# Altium project STM32-PCB.PrjPcb
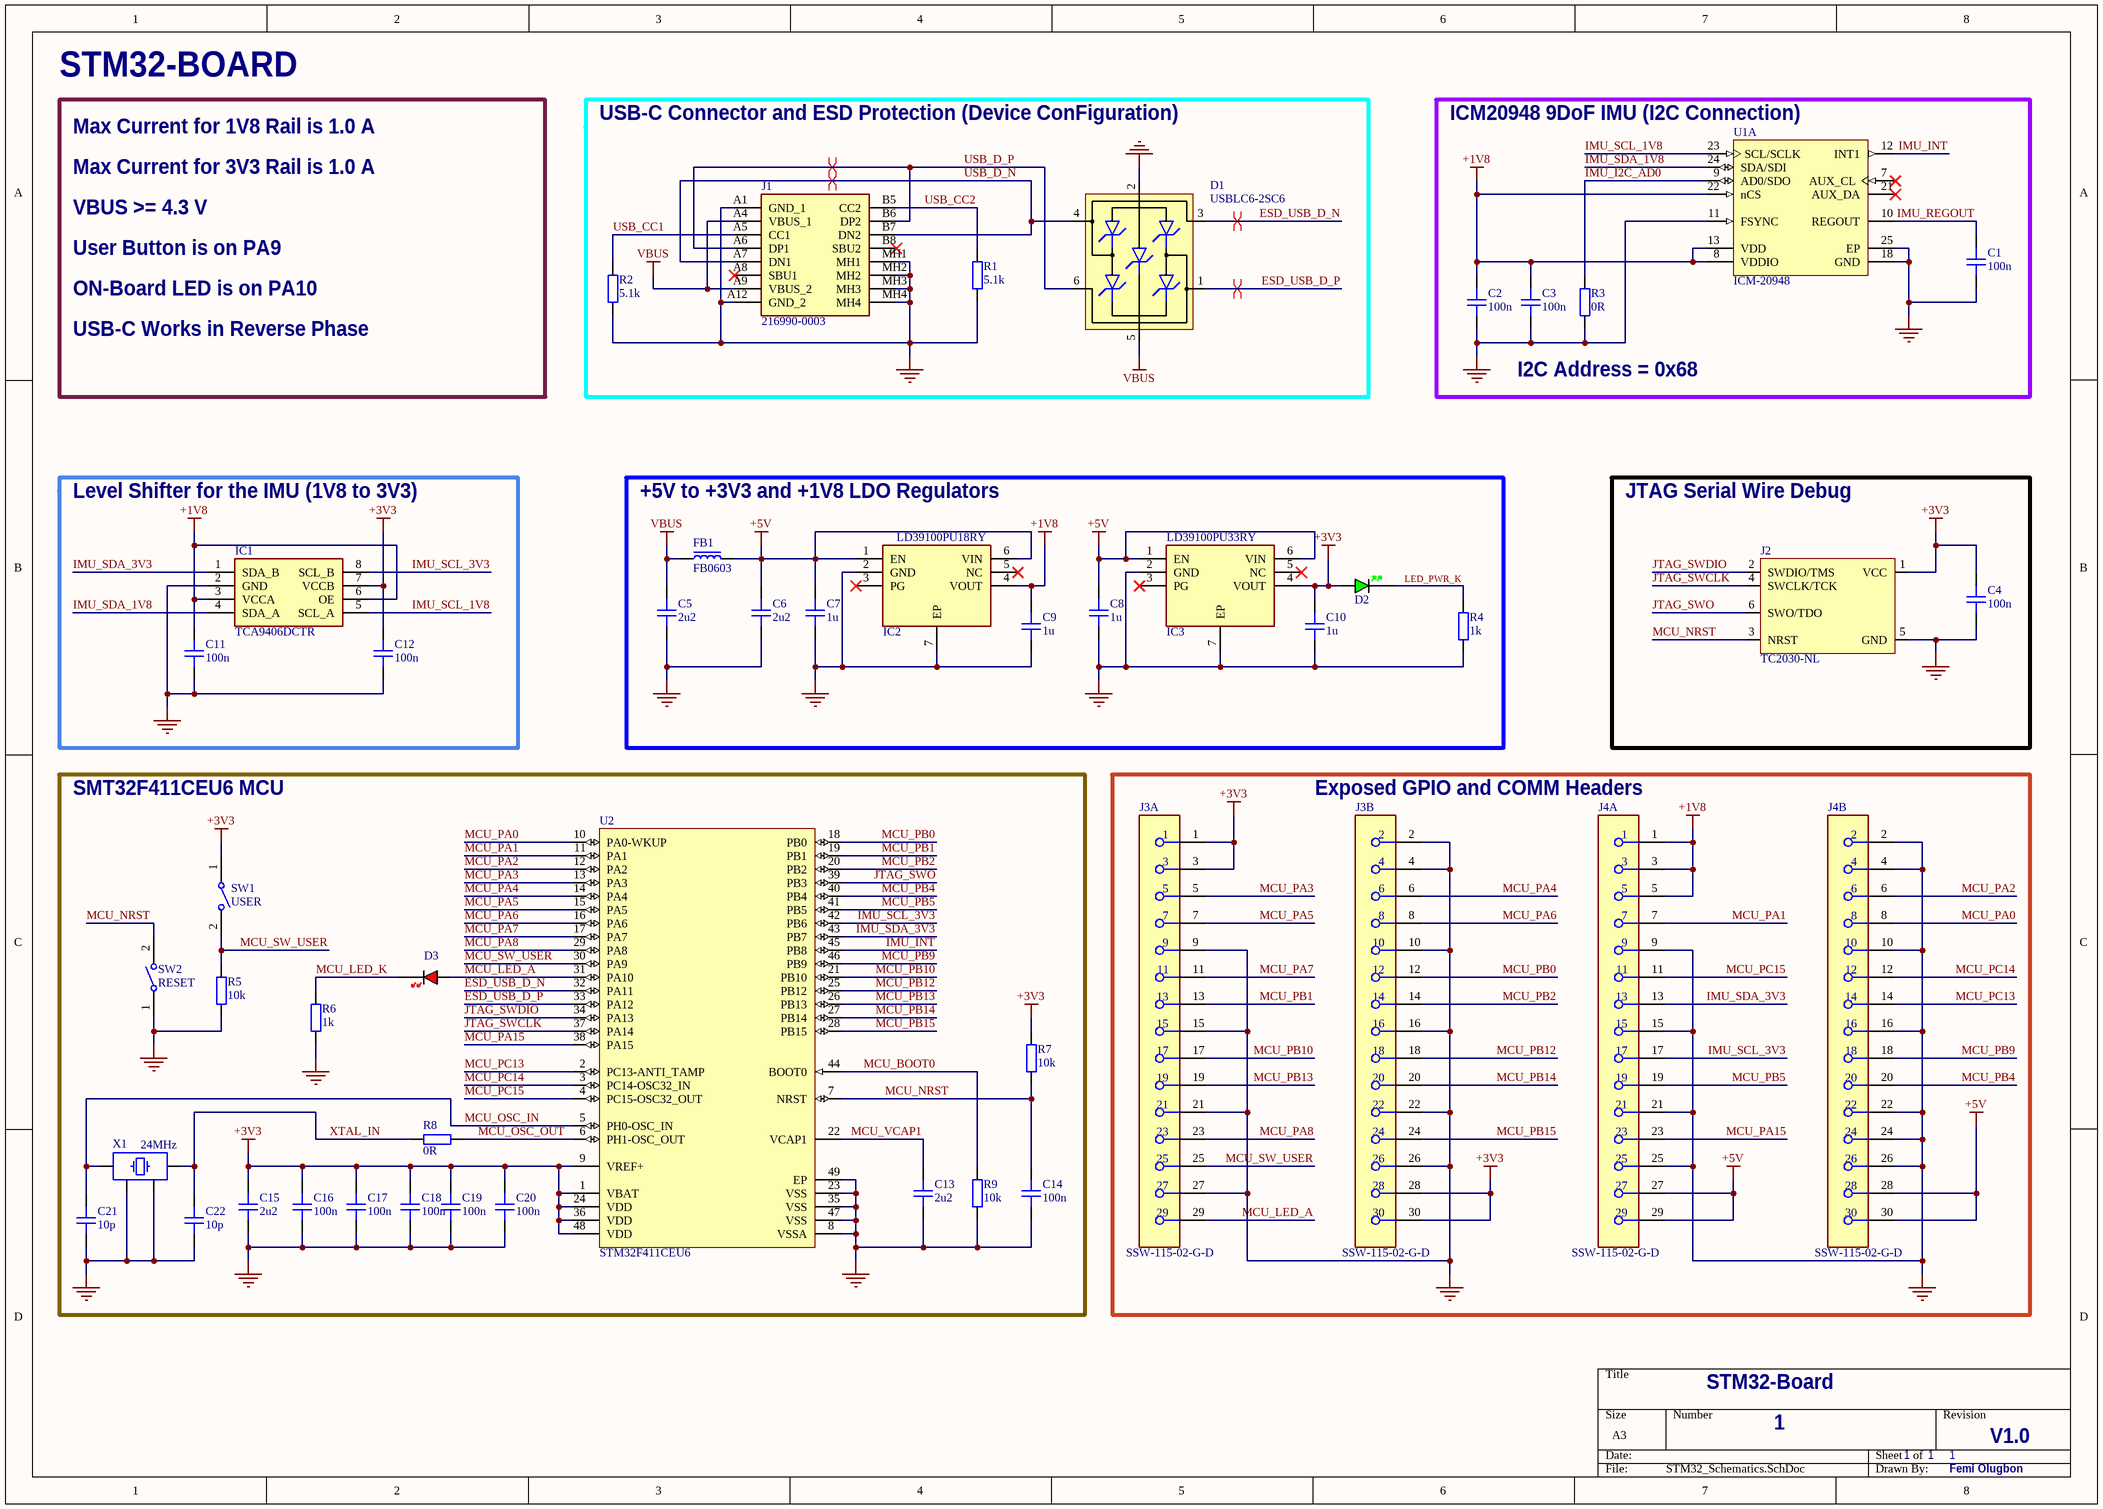
[diagram p0: STM32_Schematics.SchDoc]
1 sheet, 47 parts. Net scope: global (net labels, ports and power ports of the same name join across sheets).
Board file: STM32_PCB.PcbDoc

## Sheet STM32_Schematics.SchDoc
size A3; SheetNumber: 1; SheetTotal: 1

### Parts
C1  100n  [CAP_0402]
C2  100n  [CAP_0402]
C3  100n  [CAP_0402]
C4  100n  [CAP_0402]
C5  2u2  [CAP_0603]
C6  2u2  [CAP_0603]
C7  1u  [CAP_0603]
C8  1u  [CAP_0603]
C9  1u  [CAP_0603]
C10  1u  [CAP_0603]
C11  100n  [CAP_0402]
C12  100n  [CAP_0402]
C13  2u2  [CAP_0603]
C14  100n  [CAP_0402]
C15  2u2  [CAP_0603]
C16  100n  [CAP_0402]
C17  100n  [CAP_0402]
C18  100n  [CAP_0402]
C19  100n  [CAP_0402]
C20  100n  [CAP_0402]
C21  10p  [CAP_0402]
C22  10p  [CAP_0402]
D1  USBLC6-2SC6  [SOT-23-6]
D2  GREEN  [LED_0402_GREEN]  (value not drawn)
D3  RED  [LED_0402_RED]  (value not drawn)
FB1  FB0603  [FB_0603]
IC1  TCA9406DCTR  [SOP65P400X130-8N]
IC2  LD39100PU18RY  [SON95P300X300X90-7N-D]
IC3  LD39100PU33RY  [SON95P300X300X90-7N-D]
J1  216990-0003  [2169900003]
J2  TC2030-NL  [TC2030-NL-FP]  (no BOM)
J3  SSW-115-02-G-D  [FP-SSW-115-02-G-D-MFG]  (parts A,B of 2)
J4  SSW-115-02-G-D  [FP-SSW-115-02-G-D-MFG]  (parts A,B of 2)
R1  5.1k  [RES_0402]
R2  5.1k  [RES_0402]
R3  0R  [RES_0402]
R4  1k  [RES_0402]
R5  10k  [RES_0402]
R6  1k  [RES_0402]
R7  10k  [RES_0402]
R8  0R  [RES_0402]
R9  10k  [RES_0402]
SW1  USER  [TECO-FSMSM-2_V]
SW2  RESET  [TECO-FSMSM-2_V]
U1  ICM-20948  [TDK-QFN-24_L]  (part A of 2)
U2  STM32F411CEU6  [STM-UFQFPN48_L]
X1  24MHz  [XTAL_3225]

### Blocks framed on the sheet
USB-C Connector and ESD Protection (Device ConFiguration): D1 J1 R1 R2
Level Shifter for the IMU (1V8 to 3V3): C11 C12 IC1
+5V to +3V3 and +1V8 LDO Regulators: C5-C10 D2 FB1 IC2 IC3 R4
JTAG Serial Wire Debug: C4 J2
SMT32F411CEU6 MCU: C13-C22 D3 R5-R9 SW1 SW2 U2 X1
Exposed GPIO and COMM Headers: J3 J4

### Nets
+1V8: C2.1 C3.1 C9.2 C11.1 IC1.3(VCCA) IC1.6(OE) IC2.4(VOUT) J4.1 J4.3 J4.5 U1.8(VDDIO) U1.13(VDD) U1.22(nCS)
+3V3: C4.1 C10.2 C12.1 C15.2 C16.1 C17.1 C18.1 C19.1 C20.1 D2.A IC1.7(VCCB) IC3.4(VOUT) J2.1(VCC) J3.1 J3.3 J3.28 J3.30 R7.2 SW1.1 U2.1(VBAT) U2.9(VREF+) U2.24(VDD) U2.36(VDD) U2.48(VDD)
+5V: C6.2 C7.2 C8.2 FB1.2 IC2.1(EN) IC2.6(VIN) IC3.1(EN) IC3.6(VIN) J4.27 J4.28 J4.29 J4.30
GND: C1.2 C2.2 C3.2 C4.2 C5.1 C6.1 C7.1 C8.1 C9.1 C10.1 C11.2 C12.2 C13.1 C14.2 C15.1 C16.2 C17.2 C18.2 C19.2 C20.2 C21.2 C22.2 D1.2(GND) IC1.2(GND) IC2.2(GND) IC2.7(EP) IC3.2(GND) IC3.7(EP) J1.A1(GND_1) J1.A12(GND_2) J1.MH1 J1.MH2 J1.MH3 J1.MH4 J2.5(GND) J3.2 J3.4 J3.9 J3.10 J3.15 J3.16 J3.21 J3.22 J3.26 J3.27 J4.2 J4.4 J4.9 J4.10 J4.15 J4.16 J4.21 J4.22 J4.24 J4.25 J4.26 R1.1 R2.1 R3.1 R4.1 R5.1 R6.2 R9.1 SW2.1 U1.11(FSYNC) U1.18(GND) U1.25(EP) U2.8(VSSA) U2.23(VSS) U2.35(VSS) U2.47(VSS) U2.49(EP) X1.2 X1.4
VBUS: C5.2 D1.5(VBUS) FB1.1 J1.A4(VBUS_1) J1.A9(VBUS_2)
ESD_USB_D_N: D1.3(IO2) U2.32(PA11)
ESD_USB_D_P: D1.1(IO1) U2.33(PA12)
IMU_I2C_AD0: R3.2 U1.9(AD0/SDO)
IMU_INT: U1.12(INT1) U2.45(PB8)
IMU_REGOUT: C1.1 U1.10(REGOUT)
IMU_SCL_1V8: IC1.5(SCL_A) U1.23(SCL/SCLK)
IMU_SCL_3V3: IC1.8(SCL_B) J4.17 U2.42(PB6)
IMU_SDA_1V8: IC1.4(SDA_A) U1.24(SDA/SDI)
IMU_SDA_3V3: IC1.1(SDA_B) J4.13 U2.43(PB7)
JTAG_SWCLK: J2.4(SWCLK/TCK) U2.37(PA14)
JTAG_SWDIO: J2.2(SWDIO/TMS) U2.34(PA13)
JTAG_SWO: J2.6(SWO/TDO) U2.39(PB3)
LED_PWR_K: D2.K R4.2
MCU_BOOT0: R9.2 U2.44(BOOT0)
MCU_LED_A: D3.A J3.29 U2.31(PA10)
MCU_LED_K: D3.K R6.1
MCU_NRST: C14.1 J2.3(NRST) R7.1 SW2.2 U2.7(NRST)
MCU_OSC_IN: C21.1 U2.5(PH0-OSC_IN) X1.1
MCU_OSC_OUT: R8.1 U2.6(PH1-OSC_OUT)
MCU_PA0: J4.8 U2.10(PA0-WKUP)
MCU_PA1: J4.7 U2.11(PA1)
MCU_PA2: J4.6 U2.12(PA2)
MCU_PA3: J3.5 U2.13(PA3)
MCU_PA4: J3.6 U2.14(PA4)
MCU_PA5: J3.7 U2.15(PA5)
MCU_PA6: J3.8 U2.16(PA6)
MCU_PA7: J3.11 U2.17(PA7)
MCU_PA8: J3.23 U2.29(PA8)
MCU_PA15: J4.23 U2.38(PA15)
MCU_PB0: J3.12 U2.18(PB0)
MCU_PB1: J3.13 U2.19(PB1)
MCU_PB2: J3.14 U2.20(PB2)
MCU_PB4: J4.20 U2.40(PB4)
MCU_PB5: J4.19 U2.41(PB5)
MCU_PB9: J4.18 U2.46(PB9)
MCU_PB10: J3.17 U2.21(PB10)
MCU_PB12: J3.18 U2.25(PB12)
MCU_PB13: J3.19 U2.26(PB13)
MCU_PB14: J3.20 U2.27(PB14)
MCU_PB15: J3.24 U2.28(PB15)
MCU_PC13: J4.14 U2.2(PC13-ANTI_TAMP)
MCU_PC14: J4.12 U2.3(PC14-OSC32_IN)
MCU_PC15: J4.11 U2.4(PC15-OSC32_OUT)
MCU_SW_USER: J3.25 R5.2 SW1.2 U2.30(PA9)
MCU_VCAP1: C13.2 U2.22(VCAP1)
USB_CC1: J1.A5(CC1) R2.2
USB_CC2: J1.B5(CC2) R1.2
USB_D_N: D1.4(IO2) J1.A7(DN1) J1.B7(DN2)
USB_D_P: D1.6(IO1) J1.A6(DP1) J1.B6(DP2)
XTAL_IN: C22.1 R8.2 X1.3

Not connected (* = marked no-connect by the designer): IC2 3(PG)* 5(NC)*; IC3 3(PG)* 5(NC)*; J1 A8(SBU1)* B8(SBU2)*; U1 7(AUX_CL)* 21(AUX_DA)*

### Layout directives
differential pair; differential pair class DIFF_USB_ESD: ESD_USB_D_N, ESD_USB_D_P
differential pair; differential pair class DIFF_USB: USB_D_N, USB_D_P

### Notes on the sheet
- STM32-BOARD
- Max Current for 1V8 Rail is 1.0 A
- Max Current for 3V3 Rail is 1.0 A
- (near U1) ICM20948 9DoF IMU (I2C Connection)
- VBUS >= 4.3 V
- User Button is on PA9
- ON-Board LED is on PA10
- USB-C Works in Reverse Phase
- I2C Address = 0x68
- STM32-Board
- 1
- V1.0
- Femi Olugbon

### Library data of the parts
C1-C4 C11 C12 C14 C16-C22 = CAP_0402: Capacitor SMD 0402; Manufacturer: *; Manufacturer Part Number: *; Distributor Link: *; LCSC: *; Rating: *; Dielectric: *
C5-C10 C13 C15 = CAP_0603: Capacitor SMD 0603; Manufacturer: *; Manufacturer Part Number: *; Distributor Link: *; LCSC: *; Rating: *; Dielectric: *
D1 = USBLC6-2SC6: Low-Capacitance ESD Protection USB; Manufacturer: STMicroelectronics; Manufacturer Part Number: USBLC6-2SC6; Distributor Link: https://www.mouser.de/ProductDetail/STMicroelectronics/USBLC6-2SC6?qs=po45yt2pPpu%2FhNIlwQdTlg%3D%3D
D2 = LED_0402_GREEN: LED 0402 GREEN SMD
D3 = LED_0402_RED: LED 0402 RED SMD
FB1 = FB_0603: Ferrite Bead SMD 0603; Manufacturer: *; Manufacturer Part Number: *; Distributor Link: *; LCSC: *
IC1 = TCA9406DCTR: Integrated Circuit; Manufacturer_Name: Texas Instruments; Datasheet Link: http://www.ti.com/lit/ds/symlink/tca9406.pdf; Height: 1.3mm; Manufacturer_Part_Number: TCA9406DCTR; Mouser Part Number: 595-TCA9406DCTR; Mouser Price/Stock: https://www.mouser.co.uk/ProductDetail/Texas-Instruments/TCA9406DCTR?qs=Ze4%2FuFuz19L6Yntu0RTUyw%3D%3D; Arrow Part Number: TCA9406DCTR; Arrow Price/Stock: https://www.arrow.com/en/products/tca9406dctr/texas-instruments?region=nac
IC2 = LD39100PU18RY: Integrated Circuit; Manufacturer_Name: STMicroelectronics; Datasheet Link: https://www.st.com/resource/en/datasheet/ld39100.pdf; Height: 0.9mm; Manufacturer_Part_Number: LD39100PU18RY; Mouser Part Number: 511-LD39100PU18RY; Mouser Price/Stock: https://www.mouser.co.uk/ProductDetail/STMicroelectronics/LD39100PU18RY?qs=aVyJF2WnouREkLb6JvLi6A%3D%3D; Arrow Part Number: LD39100PU18RY; Arrow Price/Stock: https://www.arrow.com/en/products/ld39100pu18ry/stmicroelectronics
IC3 = LD39100PU33RY: Integrated Circuit; Manufacturer_Name: STMicroelectronics; Datasheet Link: http://www.st.com/content/ccc/resource/technical/document/datasheet/72/02/e5/ee/df/36/40/5e/CD00233788.pdf/files/CD00233788.pdf/jcr:content/translations/en.CD00233788.pdf; Height: 0.9mm; Manufacturer_Part_Number: LD39100PU33RY; Mouser Part Number: 511-LD39100PU33RY; Mouser Price/Stock: https://www.mouser.co.uk/ProductDetail/STMicroelectronics/LD39100PU33RY?qs=xwQlLnDx56AZF44f%2FmwzdQ%3D%3D; Arrow Part Number: LD39100PU33RY; Arrow Price/Stock: https://www.arrow.com/en/products/ld39100pu33ry/stmicroelectronics?region=nac
J1 = 216990-0003: Connector; Manufacturer_Name: Molex; Datasheet Link: https://www.molex.com/pdm_docs/sd/2169900003_sd.pdf; Height: 3.36mm; Manufacturer_Part_Number: 216990-0003; Mouser Part Number: 538-216990-0003; Mouser Price/Stock: https://www.mouser.co.uk/ProductDetail/Molex/216990-0003?qs=DRkmTr78QASn0GILUGAYCA%3D%3D; Arrow Part Number: 216990-0003; Arrow Price/Stock: https://www.arrow.com/en/products/216990-0003/molex?region=nac
J2 = TC2030-NL: Tag-Connect No-Solder SWD Debug Connector (No Legs) DO NOT PLACE; Manufacturer: Tag-Connect; Manufacturer Part Number: TC2030-NL-FP
J3 J4 = CMP-00575-00296320-1: SSW-115-02-G-D SSW - Samtec 2.54mm Dual Row Straight Socket Strip 8.5mm Profile (mcv)(TO22); Manufacturer Lifecycle Status: PRODUCTION; NexarPartId: 296320; Contact Resistance: 10mΩ; Voltage Rating (AC): 465V; Voltage Rating: 550V; Gender: Receptacle; Current Rating: 6.9A; Connector Type: Receptacle, Socket; Voltage Rating (DC): 655V; Number of Positions: 30; Housing Color: Black; Radiation Hardening: No; Pitch: 2.54mm; REACH SVHC: No SVHC; Row Spacing: 2.54mm; Contact Material: Bronze; RoHS: Compliant; Housing Material: Plastic; Mount: Through Hole; Packaging: Bulk; Lead Pitch: 2.54mm; Orientation: Straight; Contact Plating: Gold; Lifecycle Status: Production; Lead Free: Lead Free; Number of Rows: 2; Termination: Solder; Color: Black; Number of Contacts: 30
R1-R9 = RES_0402: Resistor SMD 0402; Manufacturer: *; Manufacturer Part Number: *; Distributor Link: *; LCSC: *
SW1 SW2 = CMP-2000-07511-1: FSMSM Push Button Switch, 50 mA, -35 to 85 degC, 2-Pin SMD, RoHS, Bulk; Manufacturer: TE Connectivity; Actuator Length: 1.07mm; Electrical Life: 20000Cycles; Actuator Material: Polyamide; Current Rating: 50mA; Illumination Type: Illuminated; Voltage Rating (DC): 24V; Contact Resistance: 100mOhm; Case\/Package: SMD/SMT; Operating Force: 180gf; Switch Travel: 0.25mm; Max Voltage Rating (DC): 12V; Throw Configuration: SPST; Packaging: LoosePiece; Max Operating Temperature: 85degC; ELV: Compliant; Package Description: 2-Pin Surface Mount Device, Body 6 x 3.5 mm, Pitch 9.19 mm; RoHSCompliant: true; Manufacturer URL: http://www.te.com/; Contact Plating: Silver; Contact Material: Brass; Mounting Technology: SurfaceMount; Contact Current Rating: 50mA; Datasheet Version: Rev. C2, 08/2014; Datasheet URL: http://www.te.com/commerce/DocumentDelivery/DDEController?Action=showdoc&DocId=Customer+Drawing%7F1437566-3%7FC2%7Fpdf%7FEnglish%7FENG_CD_1437566-3_C2_1437566_3_1_c.dwg.pdf%7F1437566-3; Mechanical Life: 20000Cycles; Package Reference: FSMSM; REACH SVHC: Unknown; Orientation: Straight; Min Operating Temperature: -35degC; Lead Free: LeadFree; Termination: GullWing; Package Quantity: 1000; Mount: SurfaceMount
U1 = CMP-2000-07532-1: World’s Lowest Power 9-Axis MEMS MotionTracking(TM) Device, 1.71 to 3.6 V, -40 to 85 degC, 24-Pin QFN, RoHS, Tape and Reel; Manufacturer: TDK; Package Description: 24-Pin Quad Flat No-lead Package, Body 3 x 3 mm, Pitch 0.4 mm; Datasheet Version: Rev. 1.3, 06/2017; Package Reference: QFN-24; Mounting Technology: SurfaceMount; Datasheet URL: https://www.invensense.com/wp-content/uploads/2016/06/DS-000189-ICM-20948-v1.3.pdf; Manufacturer URL: http://www.tdk.com/
U2 = CMP-0243-00165-1: ARM Cortex-M4 32-bit MCU+FPU, 512 KB Flash, 128 KB RAM, 36 I/Os, 48-Pin UFQFPN, -40 to 85 degC, Tray; Operating Frequency(F) (Processor speed) (MHz): 100; FLASH Size (Prog) (kB): 512; Internal RAM Size (kB): 128; I/Os (High Current): 36; Supply Voltage(Vcc) min (V): 1.7; Package Reference: 48-Pin Ultra Thin Fine Pitch Quad Flat No-Lead, 7 x 7 x 0.6 mm Body, 0.5 mm Pitch, Exposed Pad; ComponentLink1Description: Manufacturer URL; ComponentLink1URL: http://www.st.com/; Packing: Tray; Package Description: UFQFPN48; Core: ARM Cortex-M4; ComponentLink2Description: Datasheet; ComponentLink2URL: http://www.st.com/st-web-ui/static/active/en/resource/technical/document/datasheet/DM00115249.pdf; DatasheetVersion: Rev. 6; Mounting Technology: Surface Mount
X1 = TSX-3225_24.0000MF15X-AC: Crystal SMD 24MHz 10PPM 7pF 3225; Manufacturer: Epson; Manufacturer Part Number: TSX-3225 24.0000MF15X-AC